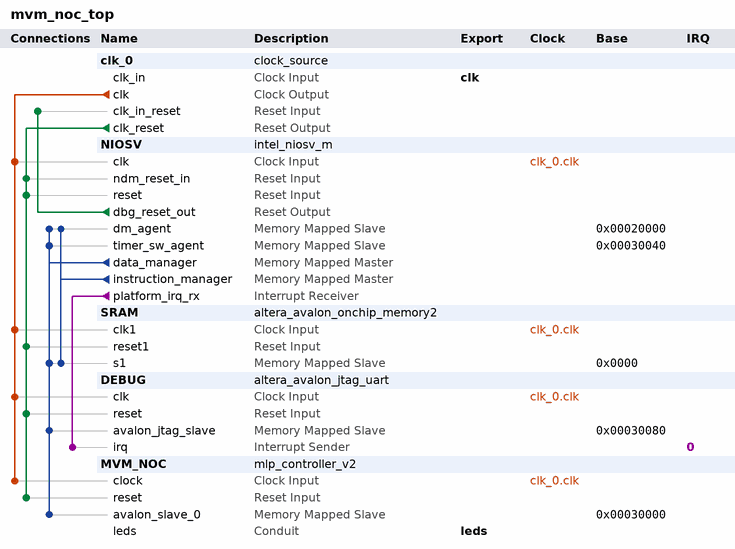
[diagram p0: system contents]
# Platform Designer (Qsys) system mvm_noc_top, Cyclone V 5CSXFC6D6F31C6
# Parameters at their usual value, and those the tool derives, are not listed.
package require -exact qsys 23.1
create_system mvm_noc_top
set_project_property DEVICE_FAMILY {Cyclone V}
set_project_property DEVICE 5CSXFC6D6F31C6

add_instance clk_0 clock_source 23.1
set_instance_parameter_value clk_0 clockFrequency 50000000

add_instance NIOSV intel_niosv_m 2.0.0
set_instance_parameter_value NIOSV enableDebugReset true
set_instance_parameter_value NIOSV enableECCLite false
set_instance_parameter_value NIOSV pipelineArch true
set_instance_parameter_value NIOSV resetSlave SRAM.s1

add_instance SRAM altera_avalon_onchip_memory2 23.1
set_instance_parameter_value SRAM dataWidth 32
set_instance_parameter_value SRAM dualPort false
set_instance_parameter_value SRAM initMemContent true
set_instance_parameter_value SRAM initializationFileName onchip_mem.hex
set_instance_parameter_value SRAM memorySize 131072

add_instance DEBUG altera_avalon_jtag_uart 23.1
set_instance_parameter_value DEBUG simInteractiveOptions NO_INTERACTIVE_WINDOWS

add_instance MVM_NOC mlp_controller_v2 1.0
set_instance_parameter_value MVM_NOC DATAW 128
set_instance_parameter_value MVM_NOC DESTW 12
set_instance_parameter_value MVM_NOC IDW 4
set_instance_parameter_value MVM_NOC USERW 75

# connections
add_connection clk_0.clk DEBUG.clk clock
add_connection clk_0.clk MVM_NOC.clock clock
add_connection clk_0.clk NIOSV.clk clock
add_connection clk_0.clk SRAM.clk1 clock
add_connection clk_0.clk_reset DEBUG.reset reset
add_connection clk_0.clk_reset MVM_NOC.reset reset
add_connection clk_0.clk_reset NIOSV.ndm_reset_in reset
add_connection clk_0.clk_reset NIOSV.reset reset
add_connection clk_0.clk_reset SRAM.reset1 reset
add_connection NIOSV.dbg_reset_out clk_0.clk_in_reset reset
add_connection NIOSV.data_manager DEBUG.avalon_jtag_slave avalon
set_connection_parameter_value NIOSV.data_manager/DEBUG.avalon_jtag_slave baseAddress 0x00030080
add_connection NIOSV.data_manager MVM_NOC.avalon_slave_0 avalon
set_connection_parameter_value NIOSV.data_manager/MVM_NOC.avalon_slave_0 baseAddress 0x00030000
add_connection NIOSV.data_manager NIOSV.dm_agent avalon
set_connection_parameter_value NIOSV.data_manager/NIOSV.dm_agent baseAddress 0x00020000
add_connection NIOSV.data_manager NIOSV.timer_sw_agent avalon
set_connection_parameter_value NIOSV.data_manager/NIOSV.timer_sw_agent baseAddress 0x00030040
add_connection NIOSV.data_manager SRAM.s1 avalon
set_connection_parameter_value NIOSV.data_manager/SRAM.s1 baseAddress 0x0000
add_connection NIOSV.instruction_manager NIOSV.dm_agent avalon
set_connection_parameter_value NIOSV.instruction_manager/NIOSV.dm_agent baseAddress 0x00020000
add_connection NIOSV.instruction_manager SRAM.s1 avalon
set_connection_parameter_value NIOSV.instruction_manager/SRAM.s1 baseAddress 0x0000
add_connection NIOSV.platform_irq_rx DEBUG.irq interrupt
set_connection_parameter_value NIOSV.platform_irq_rx/DEBUG.irq irqNumber 0

# exported interfaces
add_interface clk clock sink
set_interface_property clk EXPORT_OF clk_0.clk_in
add_interface leds conduit end
set_interface_property leds EXPORT_OF MVM_NOC.leds

set_interconnect_requirement {$system} qsys_mm.clockCrossingAdapter HANDSHAKE
set_interconnect_requirement {$system} qsys_mm.enableEccProtection FALSE
set_interconnect_requirement {$system} qsys_mm.insertDefaultSlave FALSE
set_interconnect_requirement {$system} qsys_mm.maxAdditionalLatency 1

save_system mvm_noc_top.qsys
